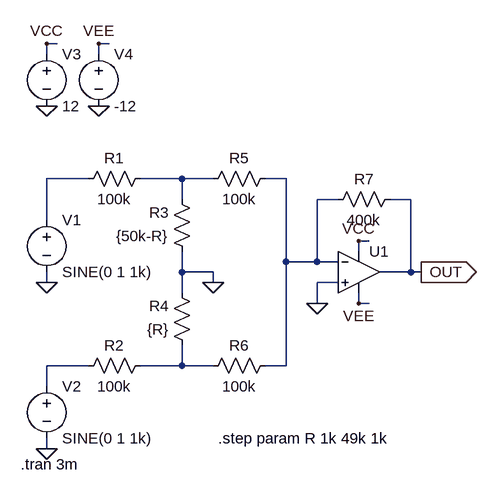
[diagram p0: schematic Dry_Wet_Pan_Test_01.asc]
Dry_Wet_Pan_Test_01.asc, the LTspice schematic file:
Version 4
SHEET 1 880 680
WIRE 64 -112 48 -112
WIRE 144 -112 128 -112
WIRE 48 -96 48 -112
WIRE 128 -96 128 -112
WIRE 112 96 48 96
WIRE 256 96 192 96
WIRE 304 96 256 96
WIRE 416 96 384 96
WIRE 256 128 256 96
WIRE 496 128 464 128
WIRE 608 128 576 128
WIRE 48 160 48 96
WIRE 544 192 528 192
WIRE 528 208 528 192
WIRE 416 224 416 96
WIRE 464 224 464 128
WIRE 464 224 416 224
WIRE 496 224 464 224
WIRE 256 240 256 208
WIRE 304 240 256 240
WIRE 608 240 608 128
WIRE 608 240 560 240
WIRE 624 240 608 240
WIRE 48 256 48 240
WIRE 304 256 304 240
WIRE 496 256 464 256
WIRE 256 272 256 240
WIRE 464 288 464 256
WIRE 528 288 528 272
WIRE 544 288 528 288
WIRE 112 384 48 384
WIRE 256 384 256 352
WIRE 256 384 192 384
WIRE 304 384 256 384
WIRE 416 384 416 224
WIRE 416 384 384 384
WIRE 48 416 48 384
WIRE 48 512 48 496
FLAG 528 192 VCC
FLAG 528 288 VEE
FLAG 464 288 0
FLAG 624 240 OUT
IOPIN 624 240 Out
FLAG 304 256 0
FLAG 48 256 0
FLAG 48 512 0
FLAG 48 -16 0
FLAG 128 -16 0
FLAG 48 -112 VCC
FLAG 128 -112 VEE
SYMBOL res 208 80 R90
WINDOW 0 0 56 VBottom 2
WINDOW 3 32 56 VTop 2
SYMATTR InstName R1
SYMATTR Value 100k
SYMBOL res 208 368 R90
WINDOW 0 0 56 VBottom 2
WINDOW 3 32 56 VTop 2
SYMATTR InstName R2
SYMATTR Value 100k
SYMBOL res 272 224 R180
WINDOW 0 36 76 Left 2
WINDOW 3 36 40 Left 2
SYMATTR InstName R3
SYMATTR Value {50k-R}
SYMBOL res 272 368 R180
WINDOW 0 36 76 Left 2
WINDOW 3 36 40 Left 2
SYMATTR InstName R4
SYMATTR Value {R}
SYMBOL res 288 112 R270
WINDOW 0 32 56 VTop 2
WINDOW 3 0 56 VBottom 2
SYMATTR InstName R5
SYMATTR Value 100k
SYMBOL res 288 400 R270
WINDOW 0 32 56 VTop 2
WINDOW 3 0 56 VBottom 2
SYMATTR InstName R6
SYMATTR Value 100k
SYMBOL Opamps\\UniversalOpamp2 528 240 R0
SYMATTR InstName U1
SYMBOL res 592 112 R90
WINDOW 0 0 56 VBottom 2
WINDOW 3 32 56 VTop 2
SYMATTR InstName R7
SYMATTR Value 400k
SYMBOL voltage 48 144 R0
WINDOW 123 0 0 Left 0
WINDOW 39 0 0 Left 0
SYMATTR InstName V1
SYMATTR Value SINE(0 1 1k)
SYMBOL voltage 48 400 R0
WINDOW 123 0 0 Left 0
WINDOW 39 0 0 Left 0
SYMATTR InstName V2
SYMATTR Value SINE(0 1 1k)
SYMBOL voltage 48 -112 R0
SYMATTR InstName V3
SYMATTR Value 12
SYMBOL voltage 128 -112 R0
SYMATTR InstName V4
SYMATTR Value -12
TEXT 312 496 Left 2 !.step param R 1k 49k 1k
TEXT 8 536 Left 2 !.tran 3m

The netlist it stands for:
* Dry_Wet_Pan_Test_01.asc
R1 N002 N001 100k
R2 N005 N004 100k
R3 0 N002 {50k-R}
R4 N005 0 {R}
R5 N002 N003 100k
R6 N005 N003 100k
XU1 0 N003 VCC VEE OUT level.2 Avol=1Meg GBW=10Meg Slew=10Meg ilimit=25m rail=0 Vos=0 phimargin=45 en=0 enk=0 in=0 ink=0 Rin=500Meg  ; pins IN+ IN- V+ V- OUT
R7 OUT N003 400k
V1 N001 0 SINE(0 1 1k)
V2 N004 0 SINE(0 1 1k)
V3 VCC 0 12
V4 VEE 0 -12
.step param R 1k 49k 1k
.tran 3m
.lib UniversalOpamps2.sub
.backanno
.end